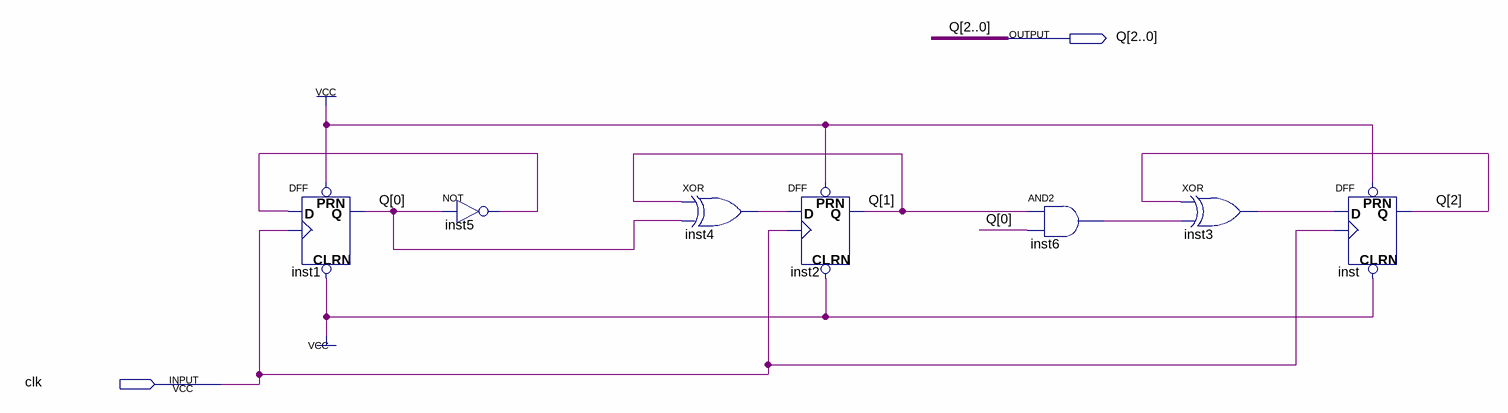
[diagram p0: schematic sheet]
// Quartus schematic lab1.bdf as structural Verilog: 7 symbols, 2 pins
module lab1 (
  input  clk,
  output [2:0] Q
);

  wire inst3_out, inst4_out, inst5_out, inst6_out;

  DFF inst1 (.CLRN(1'b1), .CLK(clk), .D(inst5_out), .PRN(1'b1), .Q(Q[0]));
  not inst5 (inst5_out, Q[0]);
  xor inst4 (inst4_out, Q[1], Q[0]);
  DFF inst2 (.CLRN(1'b1), .CLK(clk), .D(inst4_out), .PRN(1'b1), .Q(Q[1]));
  and inst6 (inst6_out, Q[1], Q[0]);
  xor inst3 (inst3_out, Q[2], inst6_out);
  DFF inst (.CLRN(1'b1), .CLK(clk), .D(inst3_out), .PRN(1'b1), .Q(Q[2]));
endmodule
